# Altium schematic sheet Input_Protection.SchDoc
size 431 x 279 mm; Organization: ORGANIZATION; Address1: ADDRESS 1; Address2: ADDRESS 2; Address3: ADDRESS 3; Address4: ADDRESS 4; Revision: -; SheetNumber: 2; SheetTotal: 6; ENG_APP_DATE: --/--/--; DSN_APP_DATE: --/--/--; CHK_APP_DATE: --/--/--
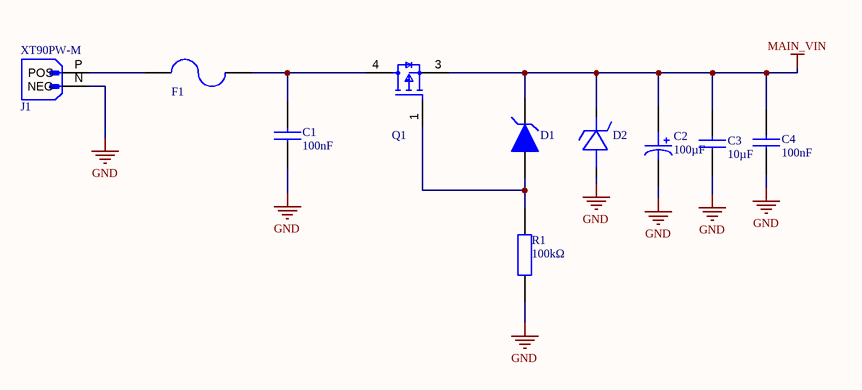
[diagram p0: Input_Protection.SchDoc]

## Parts
C1  value 100nF  [CAP_0603]  (hidden comment: CGA3E2X7R1H104K080AA)
C2  value 100µF  [CAP ALUM SMD]  (hidden comment: EEH-ZA1V101P)
C3  value 10µF  [CAP_1206]  (hidden comment: C3216X7R1H106K160AC)
C4  value 100nF  [CAP_0603]  (hidden comment: CGA3E2X7R1H104K080AA)
D1  BZT52C15  [SOD323]  (value not drawn)
D2  SMCJ58A  [SMC (DO-214AB)]  (value not drawn)
F1  Littelfuse 0452010.MRL  [FUSE_2410]  (value not drawn)
J1  XT90PW-M  [XT90PW-M]
Q1  SQM120P06-07L  [D2PAK]  (value not drawn)
R1  value 100kΩ  [RES_0603]  (hidden comment: CRCW0603100KFKEA)

## Nets
GND: C1.1 C2.2(A) C3.1 C4.1 D2.2 J1.N(NEG) R1.1
MAIN_VIN: C2.1(C) C3.2 C4.2 D1.1 D2.1 Q1.3(S)
NetC1_2: C1.2 F1.2 Q1.4(D)
NetD1_2: D1.2 Q1.1(G) R1.2
NetF1_1: F1.1 J1.P(POS)

## Notes on the sheet
- DWG. NO.
- REV.
- SHT.
- THIS DOCUMENT AND THE DATA DISCLOSED HEREIN OR HEREWITH IS THE PROPERTY OF ALTIUM LIMITED AND MAY BE FREELY DISTRIBUTED IN WHOLE. NO RIGHTS ARE RESERVED OR EXPRESS OR IMPLIED WARANTEE GIVEN.
- REVISION
- DESCRIPTION
- DATE
- APPROVED
- ENG:
- APPROVALS
- PROJECT
- DSN:
- CHK:
- REFERENCE DOCUMENTS
- PROJECT REVISION:
- TITLE
- DOCUMENT REVISION:
- DESIGN ITEM:
- BOM:
- FAB DWG:
- PCB DWG:
- ASSY DWG:
- SCALE:
- SIZE
- B
- CAGE CODE
- FILE NAME
- DWG NO.
- SHEET
- OF
- REV

## Library data of the parts
C1 C4 = CGA3E2X7R1H104K080AA: CGA Series 0603 100 nF 50 V ±10 % Tolerance X7R SMT Multilayer Ceramic Capacitor; Manufacturer: TDK; Manufacturer Lifecycle Status: PRODUCTION; Tolerance: 10%; Voltage: 50V; Supplier: Farnell; Supplier Part Number: CGA3E2X7R1H104K080AA; Manufacturer Part Number: CGA3E2X7R1H104K080AA; RoHS: Compliant; Category: Ceramic Capacitors; Stock: 155038; Pricing: 10=0,0336, 100=0,0286, 500=0,0215, 1000=0,0184, 2000=0,0173 (EUR); Case/Package: 0603; Case Code (Imperial): 0603; Case Code (Metric): 1608; China RoHS: Compliant; Composition: Ceramic; Depth: 800µm; Dielectric: X7R; Dielectric Material: Ceramic; Height: 800µm; Lead Free: Lead Free; Length: 1.6mm; Lifecycle Status: Production; Material: Ceramic; Max Length: 1.7mm; Max Operating Temperature: 125°C; Max Width: 900µm; Min Length: 1.5mm; Min Operating Temperature: -55°C; Min Width: 700µm; Mounting Technology: Surface Mount; Number of Terminals: 2; Radiation Hardening: No; Ratings: AEC-Q200; REACH SVHC: Yes; Schedule B: 8532240020, 8532240020|8532240020|8532240020|8532240020|8532240020; Termination: SMD/SMT; Thickness: 889µm; Voltage Rating: 50V; Voltage Rating (DC): 50V; Weight: 2.012816mg; Width: 800µm; ComponentLink1URL: https://datasheet.octopart.com:443/CGA3E2X7R1H104K080AA-TDK-datasheet-165583812.pdf?src-supplier=IHS; ComponentLink1Description: https://datasheet.octopart.com:443/CGA3E2X7R1H104K080AA-TDK-datasheet-165583812.pdf?src-supplier=IHS; ComponentLink2URL: https://datasheet.octopart.com:443/CGA3E2X7R1H104K080AA-TDK-datasheet-138890726.pdf?src-supplier=Upverter; ComponentLink2Description: https://datasheet.octopart.com:443/CGA3E2X7R1H104K080AA-TDK-datasheet-138890726.pdf?src-supplier=Upverter; ComponentLink3URL: https://datasheet.octopart.com:443/CGA3E2X7R1H104K080AA-TDK-datasheet-43457115.pdf?src-supplier=Upverter; ComponentLink3Description: https://datasheet.octopart.com:443/CGA3E2X7R1H104K080AA-TDK-datasheet-43457115.pdf?src-supplier=Upverter; ComponentLink4URL: https://datasheet.octopart.com:443/CGA3E2X7R1H104K080AA-TDK-datasheet-151546526.pdf?src-supplier=ODG+(Origin+Data+Global); ComponentLink4Description: https://datasheet.octopart.com:443/CGA3E2X7R1H104K080AA-TDK-datasheet-151546526.pdf?src-supplier=ODG+(Origin+Data+Global); ComponentLink5URL: https://datasheet.octopart.com:443/CGA3E2X7R1H104K080AA-TDK-datasheet-43366117.pdf?src-supplier=Newark; ComponentLink5Description: https://datasheet.octopart.com:443/CGA3E2X7R1H104K080AA-TDK-datasheet-43366117.pdf?src-supplier=Newark; ComponentLink6URL: https://datasheet.octopart.com:443/CGA3E2X7R1H104K080AA-TDK-datasheet-23766614.pdf?src-supplier=Newark; ComponentLink6Description: https://datasheet.octopart.com:443/CGA3E2X7R1H104K080AA-TDK-datasheet-23766614.pdf?src-supplier=Newark; ComponentLink7URL: https://datasheet.octopart.com:443/CGA3E2X7R1H104K080AA-TDK-datasheet-13444418.pdf?src-supplier=Newark; ComponentLink7Description: https://datasheet.octopart.com:443/CGA3E2X7R1H104K080AA-TDK-datasheet-13444418.pdf?src-supplier=Newark; ComponentLink8URL: https://datasheet.octopart.com:443/CGA3E2X7R1H104K080AA.-TDK-datasheet-159510193.pdf?src-supplier=Newark; ComponentLink8Description: https://datasheet.octopart.com:443/CGA3E2X7R1H104K080AA.-TDK-datasheet-159510193.pdf?src-supplier=Newark; ComponentLink9URL: https://datasheet.octopart.com:443/CGA3E2X7R1H104K080AA-TDK-datasheet-136412745.pdf?src-supplier=element14+APAC; ComponentLink9Description: https://datasheet.octopart.com:443/CGA3E2X7R1H104K080AA-TDK-datasheet-136412745.pdf?src-supplier=element14+APAC; ComponentLink10URL: https://datasheet.octopart.com:443/CGA3E2X7R1H104K080AA-TDK-datasheet-21217900.pdf?src-supplier=Farnell; ComponentLink10Description: https://datasheet.octopart.com:443/CGA3E2X7R1H104K080AA-TDK-datasheet-21217900.pdf?src-supplier=Farnell; ComponentLink11URL: https://datasheet.octopart.com:443/CGA3E2X7R1H104K080AA-TDK-datasheet-164882302.pdf?src-supplier=Burklin+Elektronik; ComponentLink11Description: https://datasheet.octopart.com:443/CGA3E2X7R1H104K080AA-TDK-datasheet-164882302.pdf?src-supplier=Burklin+Elektronik; ComponentLink12URL: https://datasheet.octopart.com:443/CGA3E2X7R1H104K080AA-TDK-datasheet-13234200.pdf?src-supplier=Future+Electronics; ComponentLink12Description: https://datasheet.octopart.com:443/CGA3E2X7R1H104K080AA-TDK-datasheet-13234200.pdf?src-supplier=Future+Electronics; ComponentLink13URL: https://datasheet.octopart.com:443/CGA3E2X7R1H104K080AA-TDK-datasheet-12527010.pdf?src-supplier=Future+Electronics; ComponentLink13Description: https://datasheet.octopart.com:443/CGA3E2X7R1H104K080AA-TDK-datasheet-12527010.pdf?src-supplier=Future+Electronics; ComponentLink14URL: https://datasheet.octopart.com:443/CGA3E2X7R1H104K080AA-TDK-datasheet-140571036.pdf?src-supplier=Arrow.cn; ComponentLink14Description: https://datasheet.octopart.com:443/CGA3E2X7R1H104K080AA-TDK-datasheet-140571036.pdf?src-supplier=Arrow.cn
C2 = EEH-ZA1V101P: Conductive Polymer Hybrid Aluminum Electrolytic Capacitors, 100µF, 35V, -55 to 105¡C; Manufacturer: Panasonic; Manufacturer Lifecycle Status: ACTIVE; Part Series: ZA (High temp. reflow); ESR (Equivalent Series Resistance): 27mΩ; Leakage Current: 35µA; Life (Hours): 10000hours; Ripple Current: 2.3A; Tolerance: 20%; Supplier: Future Electronics; Supplier Part Number: EEH-ZA1V101P; Manufacturer Part Number: EEH-ZA1V101P; RoHS: Compliant; Category: Polymer Capacitors; Stock: 1000; Pricing: 500=0,335, 1000=0,33, 1500=0,325, 5000=0,315 (USD); ComponentLink1URL: https://datasheet.octopart.com:443/EEH-ZA1V101P-Panasonic-datasheet-136612405.pdf?src-supplier=Electro+Sonic; ComponentLink1Description: https://datasheet.octopart.com:443/EEH-ZA1V101P-Panasonic-datasheet-136612405.pdf?src-supplier=Electro+Sonic; ComponentLink2URL: https://datasheet.octopart.com:443/EEH-ZA1V101P-Panasonic-datasheet-154840537.pdf?src-supplier=Electro+Sonic; ComponentLink2Description: https://datasheet.octopart.com:443/EEH-ZA1V101P-Panasonic-datasheet-154840537.pdf?src-supplier=Electro+Sonic; ComponentLink3URL: https://datasheet.octopart.com:443/EEH-ZA1V101P-Panasonic-datasheet-68301292.pdf?src-supplier=Future+Electronics; ComponentLink3Description: https://datasheet.octopart.com:443/EEH-ZA1V101P-Panasonic-datasheet-68301292.pdf?src-supplier=Future+Electronics; Case/Package: 3333; Country of Origin: Japan; Diameter: 8mm; Export Control Classification Number (ECCN) Code: EAR99; Height: 10.2mm; Harmonized Tariff Schedule (HTS) Code: 8532.22.00.20; Introduction Date: 2019-05-31; Length: 10.2mm; Lifecycle Status: Production; Material: Polymer; Max Operating Temperature: 105°C; Min Operating Temperature: -55°C; Mounting Technology: Surface Mount; Number of Terminals: 2; Ratings: AEC-Q200; REACH SVHC: Yes; Voltage Rating: 35V; Voltage Rating (DC): 35V; Width: 8.3mm; ComponentLink4URL: https://datasheet.octopart.com:443/EEHZA1V101P-Panasonic-datasheet-68301292.pdf?src-supplier=Panasonic; ComponentLink4Description: https://datasheet.octopart.com:443/EEHZA1V101P-Panasonic-datasheet-68301292.pdf?src-supplier=Panasonic; ComponentLink5URL: https://datasheet.octopart.com:443/EEHZA1V101P-Panasonic-datasheet-137675046.pdf?src-supplier=TME; ComponentLink5Description: https://datasheet.octopart.com:443/EEHZA1V101P-Panasonic-datasheet-137675046.pdf?src-supplier=TME
C3 = C3216X7R1H106K160AC: 50V 10uF X7R 卤10% 1206 Multilayer Ceramic Capacitors MLCC - SMD/SMT ROHS; Manufacturer: TDK; Manufacturer Lifecycle Status: PRODUCTION; Supplier: Farnell; Supplier Part Number: C3216X7R1H106K160AC; Manufacturer Part Number: C3216X7R1H106K160AC; RoHS: Compliant; Category: Ceramic Capacitors; Stock: 6363; Pricing: 5=0,77, 50=0,378, 250=0,344, 500=0,286, 1000=0,268, 2000=0,259 (EUR); Case/Package: 1206; Case Code (Metric): 3216; China RoHS: Compliant; Dielectric: X7R; Dielectric Material: Ceramic; Export Control Classification Number (ECCN) Code: EAR99; Height: 1.6mm; Harmonized Tariff Schedule (HTS) Code: 8532.24.00.20; Introduction Date: 2018-03-29; Lead Free: Lead Free; Length: 3.2mm; Lifecycle Status: Production; Material: Ceramic; Max Length: 3.5mm; Max Operating Temperature: 125°C; Max Width: 1.9mm; Min Length: 3.1mm; Min Operating Temperature: -55°C; Min Width: 1.5mm; Mounting Technology: Surface Mount; Number of Terminals: 2; REACH SVHC: Yes; Schedule B: 8532240020, 8532240020|8532240020|8532240020|8532240020|8532240020; Thickness: 1.6mm; Voltage Rating: 50V; Voltage Rating (DC): 50V; Width: 1.6mm; ComponentLink1URL: https://datasheet.octopart.com:443/C3216X7R1H106K160AC-TDK-datasheet-175423548.pdf?src-supplier=TME; ComponentLink1Description: https://datasheet.octopart.com:443/C3216X7R1H106K160AC-TDK-datasheet-175423548.pdf?src-supplier=TME; ComponentLink2URL: https://datasheet.octopart.com:443/C3216X7R1H106K160AC-TDK-datasheet-182135025.pdf?src-supplier=TME; ComponentLink2Description: https://datasheet.octopart.com:443/C3216X7R1H106K160AC-TDK-datasheet-182135025.pdf?src-supplier=TME; ComponentLink3URL: https://datasheet.octopart.com:443/C3216X7R1H106K160AC-TDK-datasheet-159617022.pdf?src-supplier=TME; ComponentLink3Description: https://datasheet.octopart.com:443/C3216X7R1H106K160AC-TDK-datasheet-159617022.pdf?src-supplier=TME; ComponentLink4URL: https://datasheet.octopart.com:443/C3216X7R1H106K160AC-TDK-datasheet-151546523.pdf?src-supplier=ODG+(Origin+Data+Global); ComponentLink4Description: https://datasheet.octopart.com:443/C3216X7R1H106K160AC-TDK-datasheet-151546523.pdf?src-supplier=ODG+(Origin+Data+Global); ComponentLink5URL: https://datasheet.octopart.com/C3216X7R1H106K160AC-TDK-datasheet-41194876.pdf; ComponentLink5Description: https://datasheet.octopart.com/C3216X7R1H106K160AC-TDK-datasheet-41194876.pdf; ComponentLink6URL: https://datasheet.octopart.com/C-Series-Ceramic-Chip-Capacitors-TDK-datasheet-family-84.pdf; ComponentLink6Description: https://datasheet.octopart.com/C-Series-Ceramic-Chip-Capacitors-TDK-datasheet-family-84.pdf; ComponentLink7URL: http://sigma.octopart.com:80/rohs_certificate/C-Series-Ceramic-Chip-Capacitors-TDK-family-108.pdf?src-supplier=Compliance+Statements; ComponentLink7Description: http://sigma.octopart.com:80/rohs_certificate/C-Series-Ceramic-Chip-Capacitors-TDK-family-108.pdf?src-supplier=Compliance+Statements
D1 = BZT52C15: BZT52C15S Series 200 mW 15 V 10 mA Surface Mount Zener Diode - SOD-323; Manufacturer: Diodes Inc.; Manufacturer Part Number: BZT52C15S-7-F; Element Configuration: Single; ESD Protection: No; Forward Current: 10mA; Forward Voltage: 900mV; Impedance: 30Ω; Max Junction Temperature (Tj): 150°C; Max Power Dissipation: 200mW; Max Reverse Leakage Current: 100nA; Number of Elements: 1; Output Current: 50mA; Polarity: Unidirectional; Reference Voltage: 15V; Reverse Voltage: 10.5V; Test Current: 5mA; Tolerance: 6%; Voltage Tolerance: 6.12%; Supplier: Arrow Electronics; Supplier Part Number: BZT52C15S-7-F; RoHS: Compliant; Category: Zener Diodes; Stock: 448; Pricing: 448=0,0267 (USD); China RoHS: Compliant; Composition: Zener; Contact Plating: Tin; Country of Origin: Mainland China, Taiwan; Export Control Classification Number (ECCN) Code: EAR99; Height: 1.2mm; Harmonized Tariff Schedule (HTS) Code: 8541.10.00.50; Introduction Date: 2002-09-04; Lead Free: Lead Free; Length: 1.8mm; Lifecycle Status: Production; Max Operating Temperature: 150°C; Min Operating Temperature: -65°C; Mounting Technology: Surface Mount; Pins: 2; Number of Terminals: 2; Packaging: Cut Tape; Peak Reverse Current: 100nA; Power Dissipation: 200mW; Power Rating: 200mW; Radiation Hardening: No; REACH SVHC: Yes; Schedule B: 8541100050, 8541100050|8541100050|8541100050|8541100050|8541100050; Termination: SMD/SMT; Voltage Rating (DC): 15V; Weight: 4.904468mg; Width: 1.4mm; Working Voltage: 15V; Zener Current: 5mA; Zener Voltage: 15V; ComponentLink1URL: https://sigma.octopart.com:443/138810740/technical_drawing/Diodes-Inc.-BZT52C15S-7-F.pdf?src-supplier=Diodes+Inc+SCT; ComponentLink1Description: https://sigma.octopart.com:443/138810740/technical_drawing/Diodes-Inc.-BZT52C15S-7-F.pdf?src-supplier=Diodes+Inc+SCT; ComponentLink2URL: https://datasheet.octopart.com:443/BZT52C15S-7-F-Diodes-Inc.-datasheet-101585694.pdf?src-supplier=element14+APAC; ComponentLink2Description: https://datasheet.octopart.com:443/BZT52C15S-7-F-Diodes-Inc.-datasheet-101585694.pdf?src-supplier=element14+APAC; ComponentLink3URL: https://datasheet.octopart.com:443/BZT52C15S-7-F-Diodes-Inc.-datasheet-11024782.pdf?src-supplier=RS+(Formerly+Allied+Electronics); ComponentLink3Description: https://datasheet.octopart.com:443/BZT52C15S-7-F-Diodes-Inc.-datasheet-11024782.pdf?src-supplier=RS+(Formerly+Allied+Electronics); ComponentLink4URL: https://datasheet.octopart.com/BZT52C15S-7-F-Diodes-Inc.-datasheet-10841798.pdf; ComponentLink4Description: https://datasheet.octopart.com/BZT52C15S-7-F-Diodes-Inc.-datasheet-10841798.pdf; ComponentLink5URL: https://datasheet.octopart.com/BZT52C15S-7-F-Diodes-Inc.-datasheet-5391111.pdf; ComponentLink5Description: https://datasheet.octopart.com/BZT52C15S-7-F-Diodes-Inc.-datasheet-5391111.pdf; ComponentLink6URL: https://datasheet.octopart.com:443/BZT52C15S-7-F-Diodes-Inc.-datasheet-101585693.pdf?src-supplier=Future+Electronics; ComponentLink6Description: https://datasheet.octopart.com:443/BZT52C15S-7-F-Diodes-Inc.-datasheet-101585693.pdf?src-supplier=Future+Electronics; ComponentLink7URL: https://datasheet.octopart.com:443/BZT52C15S-7-F-Diodes-Inc.-datasheet-12513818.pdf?src-supplier=Future+Electronics; ComponentLink7Description: https://datasheet.octopart.com:443/BZT52C15S-7-F-Diodes-Inc.-datasheet-12513818.pdf?src-supplier=Future+Electronics; ComponentLink8URL: https://datasheet.octopart.com:443/BZT52C15S-7-F-Diodes-Inc.-datasheet-10941054.pdf?src-supplier=Future+Electronics; ComponentLink8Description: https://datasheet.octopart.com:443/BZT52C15S-7-F-Diodes-Inc.-datasheet-10941054.pdf?src-supplier=Future+Electronics; ComponentLink9URL: https://datasheet.octopart.com:443/BZT52C15S-7-F-Diodes-Inc.-datasheet-10839781.pdf?src-supplier=Future+Electronics; ComponentLink9Description: https://datasheet.octopart.com:443/BZT52C15S-7-F-Diodes-Inc.-datasheet-10839781.pdf?src-supplier=Future+Electronics; ComponentLink10URL: https://datasheet.octopart.com:443/BZT52C15S-7-F-Diodes-Inc.-datasheet-10405015.pdf?src-supplier=Future+Electronics; ComponentLink10Description: https://datasheet.octopart.com:443/BZT52C15S-7-F-Diodes-Inc.-datasheet-10405015.pdf?src-supplier=Future+Electronics; ComponentLink11URL: https://datasheet.octopart.com:443/BZT52C15S-7-F-Diodes-Inc.-datasheet-5318325.pdf?src-supplier=Future+Electronics; ComponentLink11Description: https://datasheet.octopart.com:443/BZT52C15S-7-F-Diodes-Inc.-datasheet-5318325.pdf?src-supplier=Future+Electronics; ComponentLink12URL: https://datasheet.octopart.com:443/BZT52C15S-7-F-Diodes-Inc.-datasheet-14050910.pdf?src-supplier=iiiC; ComponentLink12Description: https://datasheet.octopart.com:443/BZT52C15S-7-F-Diodes-Inc.-datasheet-14050910.pdf?src-supplier=iiiC; ComponentLink13URL: https://datasheet.octopart.com:443/BZT52C15S-7-F-Diodes-Inc.-datasheet-120913.pdf?src-supplier=DigiKey; ComponentLink13Description: https://datasheet.octopart.com:443/BZT52C15S-7-F-Diodes-Inc.-datasheet-120913.pdf?src-supplier=DigiKey; ComponentLink14URL: https://datasheet.octopart.com:443/BZT52C15S-7-F-Diodes-Inc.-datasheet-1309.pdf?src-supplier=Mouser; ComponentLink14Description: https://datasheet.octopart.com:443/BZT52C15S-7-F-Diodes-Inc.-datasheet-1309.pdf?src-supplier=Mouser; ComponentLink15URL: http://sigma.octopart.com:80/15616907/materials_sheet/Diodes-Inc.-BZT52C15S-7-F.pdf?src-supplier=Compliance+Statements; ComponentLink15Description: http://sigma.octopart.com:80/15616907/materials_sheet/Diodes-Inc.-BZT52C15S-7-F.pdf?src-supplier=Compliance+Statements
D2 = SMCJ58A: Diode TVS Single Uni-Directional 58V 1.5kW 2-Pin DO-214AB; Manufacturer: Taiwan Semiconductor; Manufacturer Lifecycle Status: ACTIVE; Breakdown Voltage: 67.8V; Clamping Voltage: 93.6V; Forward Voltage: 1V; Max Breakdown Voltage: 71.2V; Max Forward Surge Current (Ifsm): 2.5A; Max Junction Temperature (Tj): 150°C; Max Power Dissipation: 5W; Max Repetitive Reverse Voltage (Vrrm): 250V; Max Reverse Leakage Current: 1µA; Max Surge Current: 200A; Min Breakdown Voltage: 64.4V; Number of Channels: 1; Peak Pulse Current: 16A; Polarity: Unidirectional; Power Dissipation: 200mW; Reverse Recovery Time: 50ns; Supplier: Farnell; Supplier Part Number: SMCJ58A; Manufacturer Part Number: SMCJ58A; RoHS: Compliant; Category: TVS Diodes; Stock: 274; Pricing: 1=0,594, 10=0,49, 100=0,342, 500=0,331, 1000=0,32, 5000=0,309 (EUR); China RoHS: Non-Compliant; Country of Origin: Mainland China, Taiwan; Export Control Classification Number (ECCN) Code: EAR99; Height: 2.62mm; Harmonized Tariff Schedule (HTS) Code: 8541.10.00.50; Introduction Date: 1998-01-21; Lead Free: Lead Free; Length: 7.11mm; Lifecycle Status: Production; Max Operating Temperature: 150°C; Min Operating Temperature: -55°C; Number of Elements: 1; Pins: 2; Number of Terminals: 2; Operating Supply Voltage: 58V; Peak Pulse Power: 1.5kW; Power Rating: 1.5kW; REACH SVHC: No; Reverse Standoff Voltage: 58V; Schedule B: 8541100080; Voltage Rating (DC): 58V; Width: 6.22mm; ComponentLink1URL: https://datasheet.octopart.com:443/SMCJ58A-Taiwan-Semiconductor-datasheet-151942226.pdf?src-supplier=TME; ComponentLink1Description: https://datasheet.octopart.com:443/SMCJ58A-Taiwan-Semiconductor-datasheet-151942226.pdf?src-supplier=TME; ComponentLink2URL: https://datasheet.octopart.com:443/SMCJ58A-Taiwan-Semiconductor-datasheet-181551142.pdf?src-supplier=IHS; ComponentLink2Description: https://datasheet.octopart.com:443/SMCJ58A-Taiwan-Semiconductor-datasheet-181551142.pdf?src-supplier=IHS; ComponentLink3URL: https://datasheet.octopart.com:443/SMCJ58A-Taiwan-Semiconductor-datasheet-182396156.pdf?src-supplier=IHS; ComponentLink3Description: https://datasheet.octopart.com:443/SMCJ58A-Taiwan-Semiconductor-datasheet-182396156.pdf?src-supplier=IHS; ComponentLink4URL: https://datasheet.octopart.com:443/SMCJ58A-Taiwan-Semiconductor-datasheet-180789152.pdf?src-supplier=IHS; ComponentLink4Description: https://datasheet.octopart.com:443/SMCJ58A-Taiwan-Semiconductor-datasheet-180789152.pdf?src-supplier=IHS; ComponentLink5URL: https://datasheet.octopart.com:443/SMCJ58A-Taiwan-Semiconductor-datasheet-137249697.pdf?src-supplier=Taiwan+Semiconductor; ComponentLink5Description: https://datasheet.octopart.com:443/SMCJ58A-Taiwan-Semiconductor-datasheet-137249697.pdf?src-supplier=Taiwan+Semiconductor; ComponentLink6URL: https://datasheet.octopart.com:443/SMCJ58A-Taiwan-Semiconductor-datasheet-34355355.pdf?src-supplier=Taiwan+Semiconductor; ComponentLink6Description: https://datasheet.octopart.com:443/SMCJ58A-Taiwan-Semiconductor-datasheet-34355355.pdf?src-supplier=Taiwan+Semiconductor; ComponentLink7URL: https://datasheet.octopart.com:443/SMCJ58A-Taiwan-Semiconductor-datasheet-65933527.pdf?src-supplier=Future+Electronics; ComponentLink7Description: https://datasheet.octopart.com:443/SMCJ58A-Taiwan-Semiconductor-datasheet-65933527.pdf?src-supplier=Future+Electronics
F1 = Littelfuse 0452010.MRL: Electric Fuse, Time Lag Blow, 10A, 72VAC, 60VDC, 50A (IR), Surface Mount, NANO; Ratings: CE, CSA, TUV; Time to Trip: 2ms; Voltage Rating (AC): 72V; Voltage Rating (DC): 60V; Supplier: Farnell; Supplier Part Number: 0452010.MRL; Manufacturer: Littelfuse; Manufacturer Part Number: 0452010.MRL; RoHS: Compliant; Category: Fuses; Stock: 195; Pricing: 1=3,24, 50=2,06, 100=1,9, 250=1,71, 500=1,57, 1000=1,46 (EUR); Current Rating: 10A; Export Control Classification Number (ECCN) Code: EAR99; Height: 2.69mm; Harmonized Tariff Schedule (HTS) Code: 8536.10.00.40; Introduction Date: 2024-06-26; Length: 6.1mm; Lifecycle Status: Production; Max Operating Temperature: 125°C; Min Operating Temperature: -55°C; Mounting Technology: Surface Mount; REACH SVHC: No; ComponentLink1URL: https://datasheet.octopart.com:443/0452010.MRL-Littelfuse-datasheet-183575671.pdf?src-supplier=Sager+Electronics; ComponentLink1Description: https://datasheet.octopart.com:443/0452010.MRL-Littelfuse-datasheet-183575671.pdf?src-supplier=Sager+Electronics
J1 = XT90PW-M: Socket; DC supply; XT90; male; PIN: 2; on PCBs; THT; Colour: yellow; Manufacturer: Amass; Category: Uncategorized; Color: Yellow; Contact Material: Brass; Manufacturer Part Number: XT90PW-M; Pins: 2; Orientation: Straight
Q1 = SQM120P06-07L: MOSFET P-CH 60V 120A TO263 / Trans MOSFET P-CH 60V 120A Automotive 3-Pin(2+Tab) D2PAK; Manufacturer: Vishay; Manufacturer Part Number: SQM120P06-07L_GE3; Drain to Source Breakdown Voltage: -60V; Drain to Source Resistance: 6.7mΩ; Element Configuration: Single; Fall Time: 32ns; Gate to Source Voltage (Vgs): 20V; Input Capacitance: 14.28nF; Max Junction Temperature (Tj): 175°C; Max Power Dissipation: 375W; Number of Channels: 1; Rise Time: 23ns; Threshold Voltage: -2V; Turn-Off Delay Time: 97ns; Turn-On Delay Time: 15ns; Supplier: Farnell; Supplier Part Number: SQM120P06-07L_GE3; RoHS: Compliant; Category: MOSFETs; Stock: 2376; Pricing: 1=4,9, 10=3,2, 100=2,51, 500=2,1, 1000=2,06 (EUR); Case/Package: TO-263; Continuous Drain Current (ID): 120A; Drain to Source Voltage (Vdss): -60V; Export Control Classification Number (ECCN) Code: EAR99; Height: 5.08mm; Introduction Date: 2010-09-09; Lead Free: Lead Free; Lifecycle Status: Production; Max Operating Temperature: 175°C; Min Breakdown Voltage: 60V; Min Operating Temperature: -55°C; Mounting Technology: Surface Mount; Number of Elements: 1; Pins: 3; Number of Terminals: 2; Packaging: Tape & Reel; Power Dissipation: 375W; Radiation Hardening: No; Rds On Max: 6.7mΩ; REACH SVHC: No; Schedule B: 8541290080, 8541290080|8541290080|8541290080|8541290080|8541290080; Weight: 1.946308g; ComponentLink1URL: https://datasheet.octopart.com:443/SQM120P06-07L_GE3-Vishay-datasheet-181368167.pdf?src-supplier=IHS; ComponentLink1Description: https://datasheet.octopart.com:443/SQM120P06-07L_GE3-Vishay-datasheet-181368167.pdf?src-supplier=IHS; ComponentLink2URL: https://datasheet.octopart.com:443/SQM120P06-07L_GE3-Vishay-datasheet-58971610.pdf?src-supplier=Upverter; ComponentLink2Description: https://datasheet.octopart.com:443/SQM120P06-07L_GE3-Vishay-datasheet-58971610.pdf?src-supplier=Upverter; ComponentLink3URL: https://datasheet.octopart.com:443/SQM120P06-07L_GE3-Vishay-datasheet-66078331.pdf?src-supplier=Newark; ComponentLink3Description: https://datasheet.octopart.com:443/SQM120P06-07L_GE3-Vishay-datasheet-66078331.pdf?src-supplier=Newark; ComponentLink4URL: https://datasheet.octopart.com:443/SQM120P06-07L_GE3-Vishay-datasheet-182431440.pdf?src-supplier=Future+Electronics; ComponentLink4Description: https://datasheet.octopart.com:443/SQM120P06-07L_GE3-Vishay-datasheet-182431440.pdf?src-supplier=Future+Electronics; ComponentLink5URL: http://sigma.octopart.com:80/rohs_statement/Vishay-company-15.pdf?src-supplier=Compliance+Statements; ComponentLink5Description: http://sigma.octopart.com:80/rohs_statement/Vishay-company-15.pdf?src-supplier=Compliance+Statements
R1 = CRCW0603100KFKEA: Res Thick Film 0603 100K Ohm 1% 1/3W ±100ppm/°C Molded SMD SMD Paper T/R; Manufacturer: Vishay; Manufacturer Part Number: CRCW0603100KFKEAHP; Max Power Dissipation: 250mW; Power Rating: 330mW; Voltage Rating: 75V; Supplier: Farnell; Supplier Part Number: CRCW0603100KFKEAHP; RoHS: Compliant; Category: Chip SMD Resistors; Stock: 78590; Pricing: 10=0,0404, 100=0,0303, 500=0,0261, 1000=0,0239, 2500=0,0223, 5000=0,0219 (EUR); Case/Package: 0603; Case Code (Imperial): 0603; Case Code (Metric): 1608; China RoHS: Non-Compliant; Composition: Thick Film; Contact Plating: Tin; Country of Origin: Israel; Depth: 850µm; Export Control Classification Number (ECCN) Code: EAR99; Features: Automotive AEC-Q200; Height: 450µm; Harmonized Tariff Schedule (HTS) Code: 8533.21.00.30; Introduction Date: 2008-07-29; Lead Free: Lead Free; Length: 1.6mm; Lifecycle Status: Production; Max Operating Temperature: 155°C; Military Standard: Not; Min Operating Temperature: -55°C; Mounting Technology: Surface Mount; Pins: 2; Number of Terminals: 2; Number of Terminations: 2; Packaging: Cut Tape; Radiation Hardening: No; Ratings: AEC-Q200; REACH SVHC: Yes; Schedule B: 8533210045, 8533210045|8533210045|8533210045|8533210045|8533210045; Temperature Coefficient: 100ppm/°C; Termination: SMD/SMT; Tolerance: 1%; Voltage Rating (DC): 75V; Weight: 2.012816mg; Width: 850µm; Working Voltage: 75V; ComponentLink1URL: https://datasheet.octopart.com:443/CRCW0603100KFKEAHP-Vishay-datasheet-13148866.pdf?src-supplier=Future+Electronics; ComponentLink1Description: https://datasheet.octopart.com:443/CRCW0603100KFKEAHP-Vishay-datasheet-13148866.pdf?src-supplier=Future+Electronics; ComponentLink2URL: https://datasheet.octopart.com:443/CRCW0603100KFKEAHP-Vishay-datasheet-13131392.pdf?src-supplier=Future+Electronics; ComponentLink2Description: https://datasheet.octopart.com:443/CRCW0603100KFKEAHP-Vishay-datasheet-13131392.pdf?src-supplier=Future+Electronics; ComponentLink3URL: https://datasheet.octopart.com:443/CRCW0603100KFKEAHP-Vishay-datasheet-12593106.pdf?src-supplier=Future+Electronics; ComponentLink3Description: https://datasheet.octopart.com:443/CRCW0603100KFKEAHP-Vishay-datasheet-12593106.pdf?src-supplier=Future+Electronics; ComponentLink4URL: https://datasheet.octopart.com:443/CRCW0603100KFKEAHP-Vishay-datasheet-12531795.pdf?src-supplier=Future+Electronics; ComponentLink4Description: https://datasheet.octopart.com:443/CRCW0603100KFKEAHP-Vishay-datasheet-12531795.pdf?src-supplier=Future+Electronics; ComponentLink5URL: https://datasheet.octopart.com:443/CRCW0603100KFKEAHP-Vishay-datasheet-12518686.pdf?src-supplier=Future+Electronics; ComponentLink5Description: https://datasheet.octopart.com:443/CRCW0603100KFKEAHP-Vishay-datasheet-12518686.pdf?src-supplier=Future+Electronics; ComponentLink6URL: https://datasheet.octopart.com:443/CRCW0603100KFKEAHP-Vishay-datasheet-12509906.pdf?src-supplier=Future+Electronics; ComponentLink6Description: https://datasheet.octopart.com:443/CRCW0603100KFKEAHP-Vishay-datasheet-12509906.pdf?src-supplier=Future+Electronics; ComponentLink7URL: https://datasheet.octopart.com:443/CRCW0603100KFKEAHP-Vishay-datasheet-10669844.pdf?src-supplier=Future+Electronics; ComponentLink7Description: https://datasheet.octopart.com:443/CRCW0603100KFKEAHP-Vishay-datasheet-10669844.pdf?src-supplier=Future+Electronics; ComponentLink8URL: https://datasheet.octopart.com:443/CRCW0603100KFKEAHP-Vishay-datasheet-8703221.pdf?src-supplier=Future+Electronics; ComponentLink8Description: https://datasheet.octopart.com:443/CRCW0603100KFKEAHP-Vishay-datasheet-8703221.pdf?src-supplier=Future+Electronics; ComponentLink9URL: https://datasheet.octopart.com:443/CRCW0603100KFKEAHP-Vishay-datasheet-62316122.pdf?src-supplier=Future+Electronics; ComponentLink9Description: https://datasheet.octopart.com:443/CRCW0603100KFKEAHP-Vishay-datasheet-62316122.pdf?src-supplier=Future+Electronics; ComponentLink10URL: https://datasheet.octopart.com:443/CRCW0603100KFKEAHP-Vishay-datasheet-12544674.pdf?src-supplier=_legacy+Avnet; ComponentLink10Description: https://datasheet.octopart.com:443/CRCW0603100KFKEAHP-Vishay-datasheet-12544674.pdf?src-supplier=_legacy+Avnet; ComponentLink11URL: https://datasheet.octopart.com:443/CRCW0603100KFKEAHP-Vishay-datasheet-87136057.pdf?src-supplier=Newark; ComponentLink11Description: https://datasheet.octopart.com:443/CRCW0603100KFKEAHP-Vishay-datasheet-87136057.pdf?src-supplier=Newark; ComponentLink12URL: https://datasheet.octopart.com:443/CRCW0603100KFKEAHP-Vishay-datasheet-66581887.pdf?src-supplier=Newark; ComponentLink12Description: https://datasheet.octopart.com:443/CRCW0603100KFKEAHP-Vishay-datasheet-66581887.pdf?src-supplier=Newark; ComponentLink13URL: https://datasheet.octopart.com:443/CRCW0603100KFKEAHP-Vishay-datasheet-37143532.pdf?src-supplier=Newark; ComponentLink13Description: https://datasheet.octopart.com:443/CRCW0603100KFKEAHP-Vishay-datasheet-37143532.pdf?src-supplier=Newark; ComponentLink14URL: https://datasheet.octopart.com:443/CRCW0603100KFKEAHP-Vishay-datasheet-8359436.pdf?src-supplier=Newark; ComponentLink14Description: https://datasheet.octopart.com:443/CRCW0603100KFKEAHP-Vishay-datasheet-8359436.pdf?src-supplier=Newark; ComponentLink15URL: https://datasheet.octopart.com:443/CRCW0603100KFKEAHP-Vishay-datasheet-112276998.pdf?src-supplier=Newark; ComponentLink15Description: https://datasheet.octopart.com:443/CRCW0603100KFKEAHP-Vishay-datasheet-112276998.pdf?src-supplier=Newark; ComponentLink16URL: https://datasheet.octopart.com:443/CRCW0603100KFKEAHP-Vishay-datasheet-62317933.pdf?src-supplier=element14+APAC; ComponentLink16Description: https://datasheet.octopart.com:443/CRCW0603100KFKEAHP-Vishay-datasheet-62317933.pdf?src-supplier=element14+APAC; ComponentLink17URL: https://datasheet.octopart.com/CRCW0603100KFKEAHP-Vishay-datasheet-83567917.pdf; ComponentLink17Description: https://datasheet.octopart.com/CRCW0603100KFKEAHP-Vishay-datasheet-83567917.pdf; ComponentLink18URL: https://datasheet.octopart.com/D-CRCW-e3-Standard-Thick-Film-Chip-Resistors-Vishay-datasheet-family-64.pdf; ComponentLink18Description: https://datasheet.octopart.com/D-CRCW-e3-Standard-Thick-Film-Chip-Resistors-Vishay-datasheet-family-64.pdf; ComponentLink19URL: https://datasheet.octopart.com:443/CRCW0603100KFKEAHP-Vishay-Dale-datasheet-47688881.pdf?src-supplier=RS+(Formerly+Allied+Electronics); ComponentLink19Description: https://datasheet.octopart.com:443/CRCW0603100KFKEAHP-Vishay-Dale-datasheet-47688881.pdf?src-supplier=RS+(Formerly+Allied+Electronics); ComponentLink20URL: http://sigma.octopart.com:80/rohs_certificate/D-CRCW-e3-Standard-Thick-Film-Chip-Resistors-Vishay-family-102.pdf?src-supplier=Compliance+Statements; ComponentLink20Description: http://sigma.octopart.com:80/rohs_certificate/D-CRCW-e3-Standard-Thick-Film-Chip-Resistors-Vishay-family-102.pdf?src-supplier=Compliance+Statements